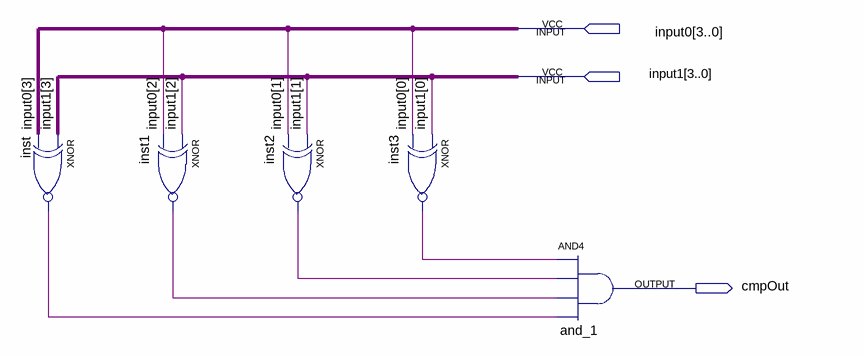
[diagram p0: schematic sheet]
// Quartus schematic EqCmpDemo.bdf as structural Verilog: 5 symbols, 3 pins
module EqCmpDemo (
  input  [3:0] input0,
  input  [3:0] input1,
  output cmpOut
);

  wire inst1_out, inst2_out, inst3_out, inst_out;

  xnor inst (inst_out, input1[3], input0[3]);
  xnor inst1 (inst1_out, input1[2], input0[2]);
  xnor inst2 (inst2_out, input1[1], input0[1]);
  xnor inst3 (inst3_out, input1[0], input0[0]);
  and and_1 (cmpOut, inst3_out, inst2_out, inst1_out, inst_out);
endmodule
